# Altium schematic sheet config-bank7.SchDoc: Config FPGA - Bank 7
size Legal; CheckedBy: J. Brinton; CompanyName: Signal Laboratories, Inc.; DrawnBy: J. Brinton; Engineer: J. Brinton; Address1: 3479 Edison Way; Address2: Menlo Park CA 94025; Address3: +1 (877) 778-8435; Address4: siglabs.com; DocumentNumber: 18; Revision: 2b; SheetNumber: 19; SheetTotal: 58
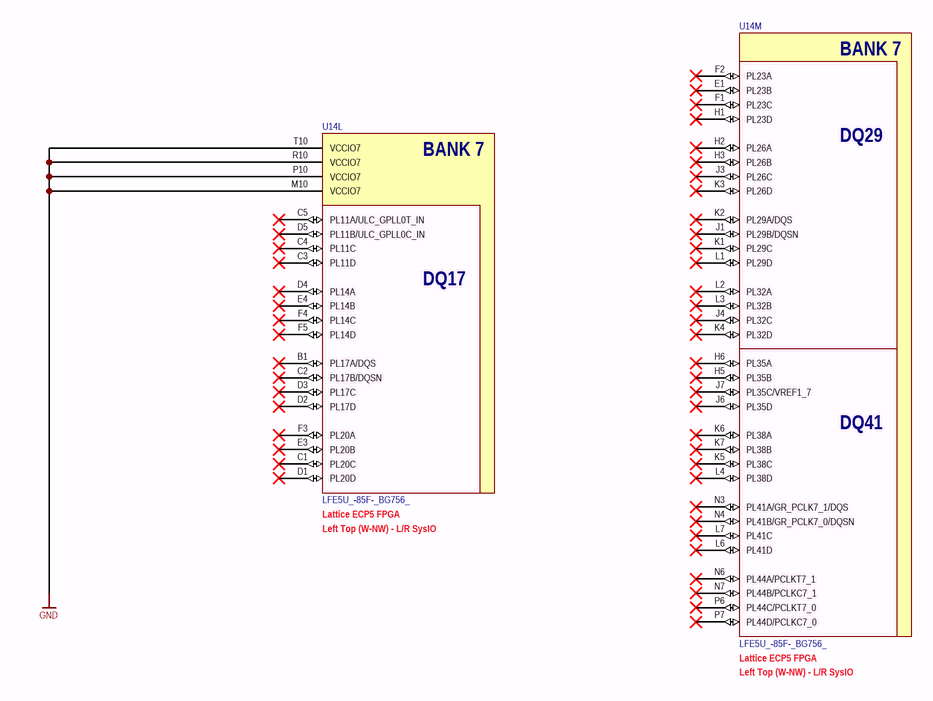
[diagram p0: config-bank7.SchDoc]

## Parts
U14  LFE5U_-85F-_BG756_  [caBGA756]  (parts L,M of 19)

## Nets
GND: U14.M10(VCCIO7) U14.P10(VCCIO7) U14.R10(VCCIO7) U14.T10(VCCIO7)

Not connected (* = marked no-connect by the designer): U14 B1(PL17A/DQS)* C1(PL20C)* C2(PL17B/DQSN)* C3(PL11D)* C4(PL11C)* C5(PL11A/ULC_GPLL0T_IN)* D1(PL20D)* D2(PL17D)* D3(PL17C)* D4(PL14A)* D5(PL11B/ULC_GPLL0C_IN)* E1(PL23B)* E3(PL20B)* E4(PL14B)* F1(PL23C)* F2(PL23A)* F3(PL20A)* F4(PL14C)* F5(PL14D)* H1(PL23D)* H2(PL26A)* H3(PL26B)* H5(PL35B)* H6(PL35A)* J1(PL29B/DQSN)* J3(PL26C)* J4(PL32C)* J6(PL35D)* J7(PL35C/VREF1_7)* K1(PL29C)* K2(PL29A/DQS)* K3(PL26D)* K4(PL32D)* K5(PL38C)* K6(PL38A)* K7(PL38B)* L1(PL29D)* L2(PL32A)* L3(PL32B)* L4(PL38D)* L6(PL41D)* L7(PL41C)* N3(PL41A/GR_PCLK7_1/DQS)* N4(PL41B/GR_PCLK7_0/DQSN)* N6(PL44A/PCLKT7_1)* N7(PL44B/PCLKC7_1)* P6(PL44C/PCLKT7_0)* P7(PL44D/PCLKC7_0)*

## Notes on the sheet
- (near U14) Left Top (W-NW) - L/R SysIO
- (near U14) Lattice ECP5 FPGA
- Title
- Engineer
- Revision
- Drawn By
- Checked By
- Date
- Sheet
- of
- (in symbol LFE5U_-85F-_BG756_, part L) BANK 7; DQ17
- (in symbol LFE5U_-85F-_BG756_, part M) BANK 7; DQ29; DQ41

## Library data of the parts
U14 = LFE5U_-85F-_BG756_: ECP5 FPGA, 85k LUT, 756-caBGA; Manufacturer: Lattice Semiconductor; Manufacturer P/N: LFE5U_-85F-_BG756_